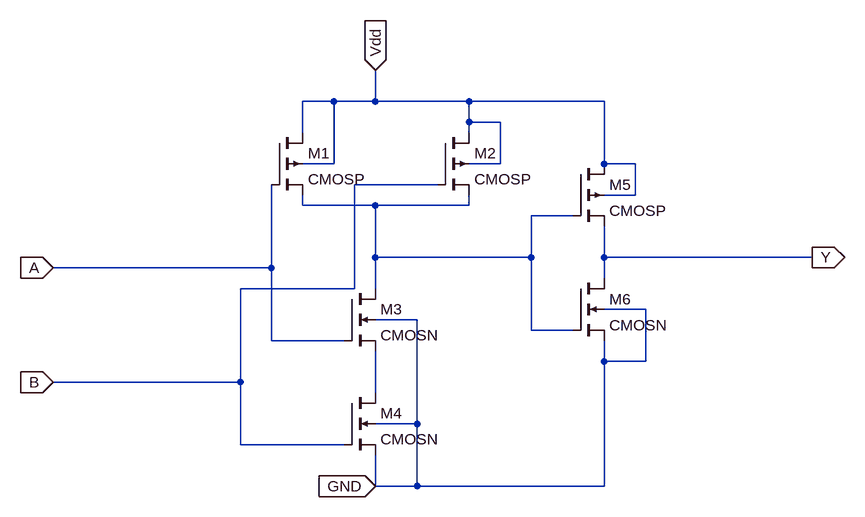
[diagram p0: schematic and_cmos.asc]
and_cmos.asc, the LTspice schematic file:
Version 4
SHEET 1 1020 696
WIRE 208 32 160 32
WIRE 272 32 272 -16
WIRE 272 32 208 32
WIRE 416 32 272 32
WIRE 624 32 416 32
WIRE 416 64 416 32
WIRE 464 64 416 64
WIRE 160 80 160 32
WIRE 416 80 416 64
WIRE 208 128 208 32
WIRE 208 128 160 128
WIRE 464 128 464 64
WIRE 464 128 416 128
WIRE 624 128 624 32
WIRE 672 128 624 128
WIRE 368 160 240 160
WIRE 672 176 672 128
WIRE 672 176 624 176
WIRE 160 192 160 176
WIRE 272 192 160 192
WIRE 416 192 416 176
WIRE 416 192 272 192
WIRE 576 208 512 208
WIRE 272 272 272 192
WIRE 512 272 512 208
WIRE 512 272 272 272
WIRE 624 272 624 224
WIRE 944 272 624 272
WIRE 112 288 112 160
WIRE 112 288 -224 288
WIRE 624 304 624 272
WIRE 240 320 240 160
WIRE 240 320 64 320
WIRE 272 320 272 272
WIRE 688 352 624 352
WIRE 336 368 272 368
WIRE 512 384 512 272
WIRE 576 384 512 384
WIRE 112 400 112 288
WIRE 224 400 112 400
WIRE 624 432 624 400
WIRE 688 432 688 352
WIRE 688 432 624 432
WIRE 64 464 64 320
WIRE 64 464 -224 464
WIRE 272 480 272 416
WIRE 336 528 336 368
WIRE 336 528 272 528
WIRE 64 560 64 464
WIRE 224 560 64 560
WIRE 272 624 272 576
WIRE 336 624 336 528
WIRE 336 624 272 624
WIRE 624 624 624 432
WIRE 624 624 336 624
FLAG 272 -16 Vdd
IOPIN 272 -16 In
FLAG 272 624 GND
IOPIN 272 624 In
FLAG -224 288 A
IOPIN -224 288 In
FLAG -224 464 B
IOPIN -224 464 In
FLAG 944 272 Y
IOPIN 944 272 Out
SYMBOL cmosp 112 80 R0
SYMATTR InstName M1
SYMATTR Value2 l=180n w=1u
SYMBOL cmosp 368 80 R0
SYMATTR InstName M2
SYMATTR Value2 l=180n w=1u
SYMBOL cmosn 224 320 R0
SYMATTR InstName M3
SYMATTR Value2 l=180n w=1u
SYMBOL cmosn 224 480 R0
SYMATTR InstName M4
SYMATTR Value2 l=180n w=1u
SYMBOL cmosp 576 128 R0
SYMATTR InstName M5
SYMBOL cmosn 576 304 R0
SYMATTR InstName M6

The netlist it stands for:
* and_cmos.asc
M1 Vdd A N001 Vdd CMOSP l=180n w=1u
M2 Vdd B N001 Vdd CMOSP l=180n w=1u
M3 N001 A N002 GND CMOSN l=180n w=1u
M4 N002 B GND GND CMOSN l=180n w=1u
M5 Vdd N001 Y Vdd CMOSP
M6 Y N001 GND GND CMOSN
.model NMOS NMOS
.model PMOS PMOS
.lib standard.mos
.backanno
.end